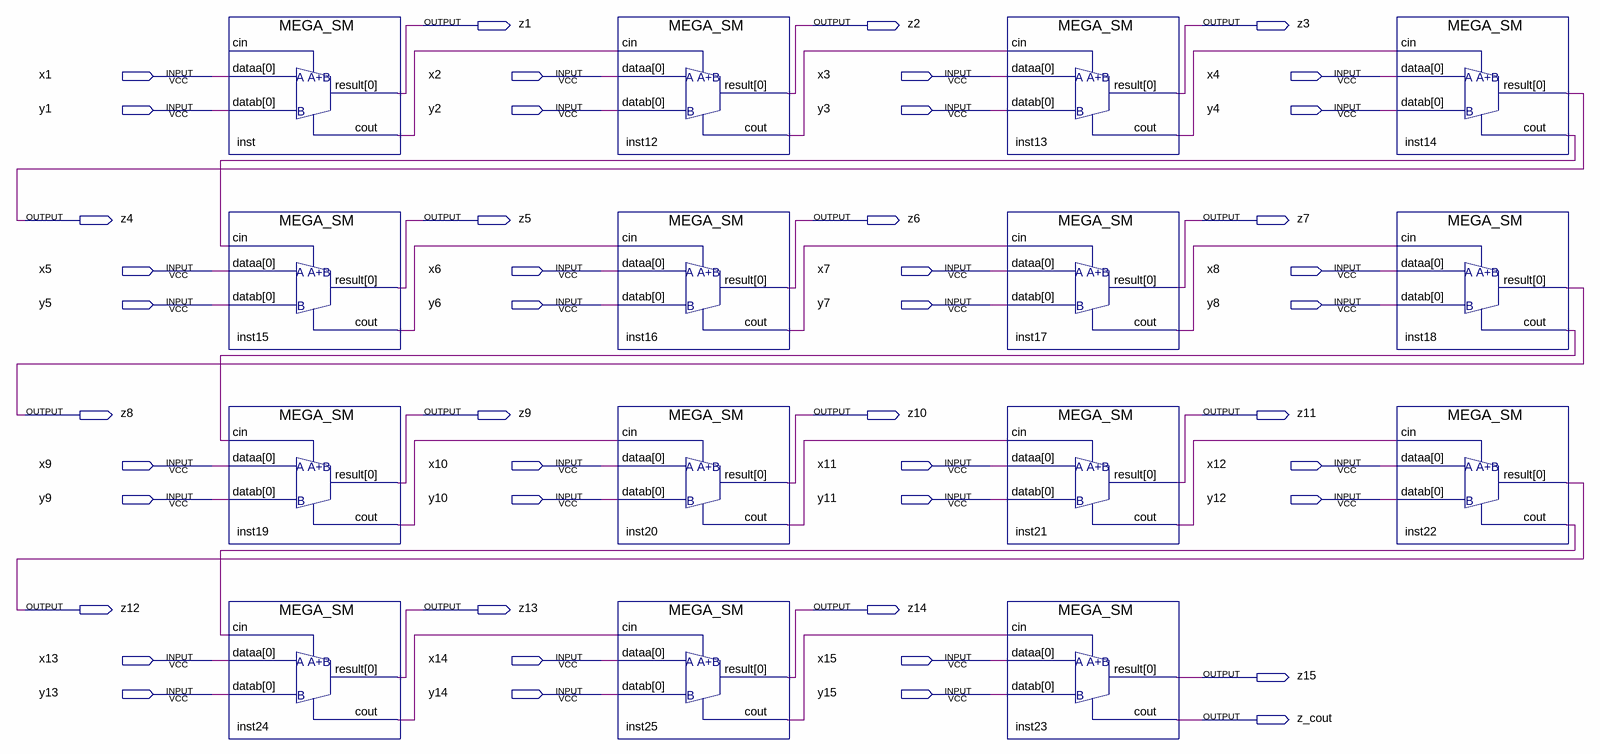
[diagram p0: schematic sheet]
// Quartus schematic MEGA_Sorokin_SM.bdf as structural Verilog: 15 symbols, 46 pins
module MEGA_Sorokin_SM (
  input  x1,
  input  x2,
  input  x3,
  input  x4,
  input  y1,
  input  y2,
  input  y3,
  input  y4,
  input  x5,
  input  x6,
  input  x7,
  input  x8,
  input  y5,
  input  y6,
  input  y7,
  input  y8,
  input  x9,
  input  x10,
  input  x11,
  input  x12,
  input  y9,
  input  y10,
  input  y11,
  input  y12,
  input  x13,
  input  x14,
  input  x15,
  input  y13,
  input  y14,
  input  y15,
  output z1,
  output z2,
  output z3,
  output z4,
  output z5,
  output z6,
  output z7,
  output z8,
  output z9,
  output z10,
  output z11,
  output z12,
  output z13,
  output z14,
  output z15,
  output z_cout
);

  wire inst12_cout, inst13_cout, inst14_cout, inst15_cout, inst16_cout, inst17_cout, inst18_cout,
       inst19_cout, inst20_cout, inst21_cout, inst22_cout, inst24_cout, inst25_cout, inst_cout;

  MEGA_SM inst (.dataa(x1), .datab(y1), .result(z1), .cout(inst_cout));  // open: cin
  MEGA_SM inst15 (.cin(inst14_cout), .dataa(x5), .datab(y5), .result(z5), .cout(inst15_cout));
  MEGA_SM inst19 (.cin(inst18_cout), .dataa(x9), .datab(y9), .result(z9), .cout(inst19_cout));
  MEGA_SM inst24 (.cin(inst22_cout), .dataa(x13), .datab(y13), .result(z13), .cout(inst24_cout));
  MEGA_SM inst12 (.cin(inst_cout), .dataa(x2), .datab(y2), .result(z2), .cout(inst12_cout));
  MEGA_SM inst16 (.cin(inst15_cout), .dataa(x6), .datab(y6), .result(z6), .cout(inst16_cout));
  MEGA_SM inst20 (.cin(inst19_cout), .dataa(x10), .datab(y10), .result(z10), .cout(inst20_cout));
  MEGA_SM inst25 (.cin(inst24_cout), .dataa(x14), .datab(y14), .result(z14), .cout(inst25_cout));
  MEGA_SM inst13 (.cin(inst12_cout), .dataa(x3), .datab(y3), .result(z3), .cout(inst13_cout));
  MEGA_SM inst17 (.cin(inst16_cout), .dataa(x7), .datab(y7), .result(z7), .cout(inst17_cout));
  MEGA_SM inst21 (.cin(inst20_cout), .dataa(x11), .datab(y11), .result(z11), .cout(inst21_cout));
  MEGA_SM inst23 (.cin(inst25_cout), .dataa(x15), .datab(y15), .result(z15), .cout(z_cout));
  MEGA_SM inst14 (.cin(inst13_cout), .dataa(x4), .datab(y4), .result(z4), .cout(inst14_cout));
  MEGA_SM inst18 (.cin(inst17_cout), .dataa(x8), .datab(y8), .result(z8), .cout(inst18_cout));
  MEGA_SM inst22 (.cin(inst21_cout), .dataa(x12), .datab(y12), .result(z12), .cout(inst22_cout));
endmodule
